# EasyEDA schematic 4R100W.json
TITLE: Sheet_1; REV: 1.0; Date: 2025-04-25; Sheet: 1/1; Drawn By: siberia-09; Company: Your Company
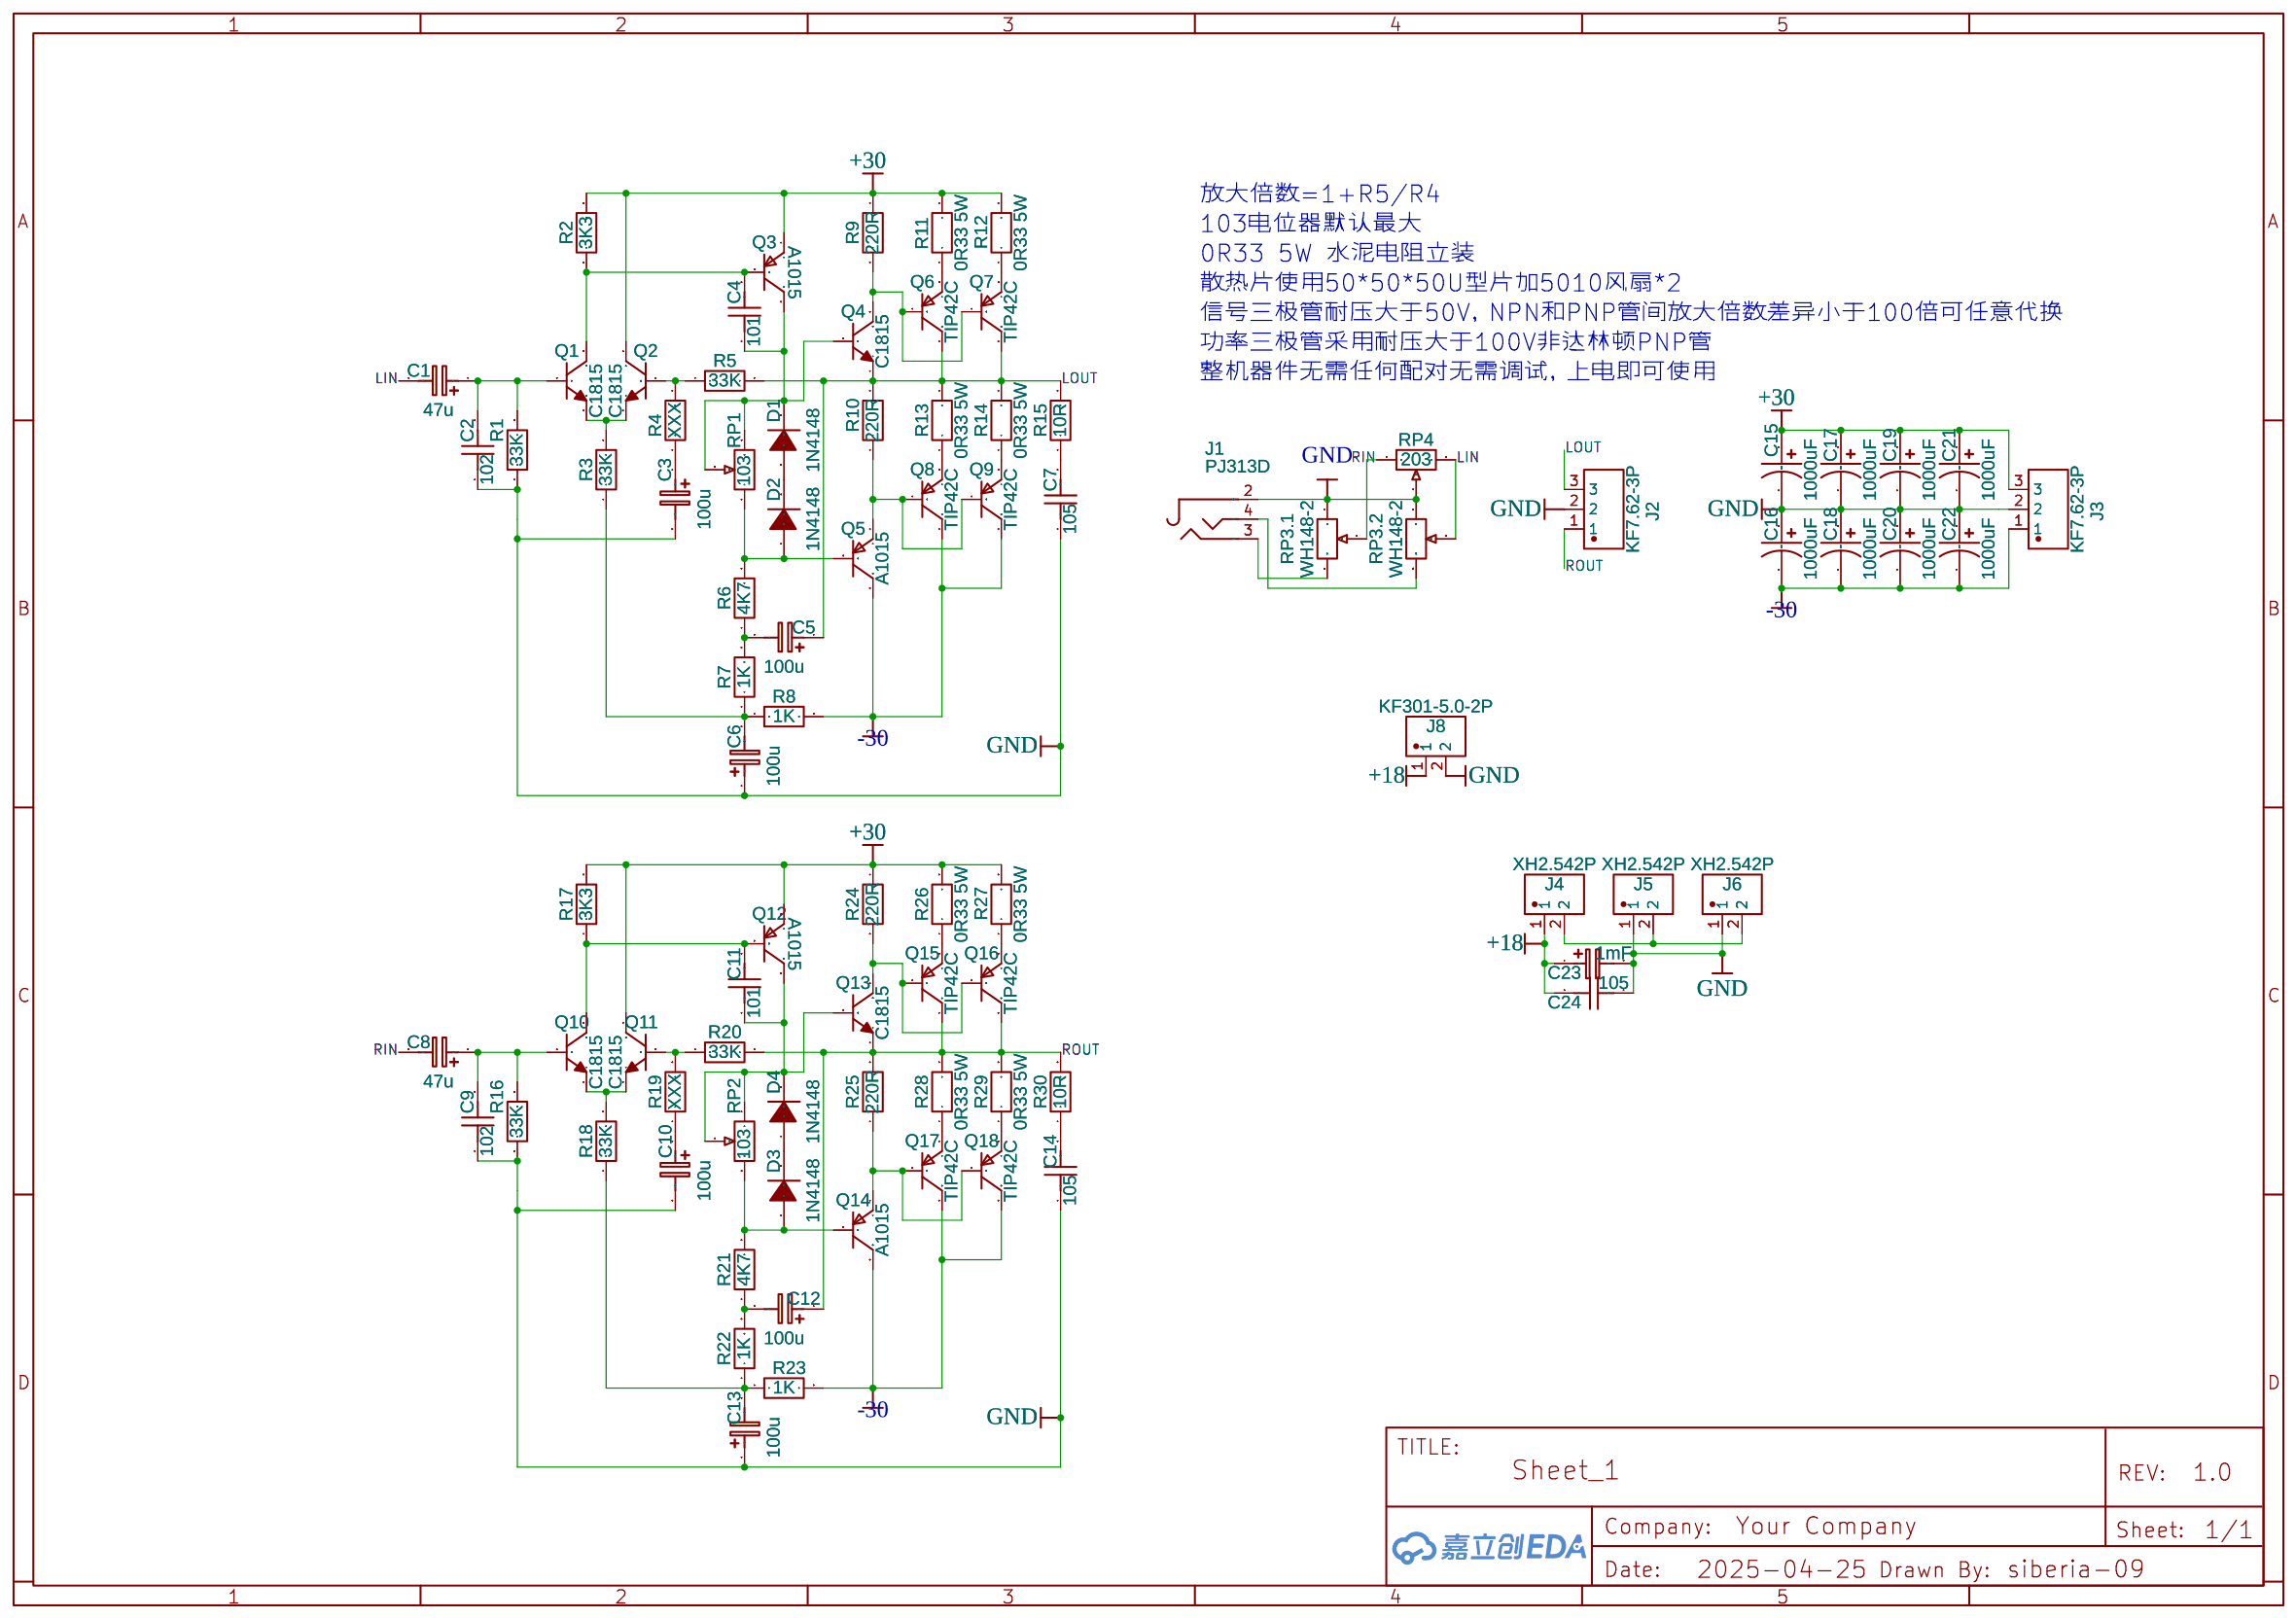
[diagram p0: schematic sheet]

## Parts
C1  47u  [CAP-8*12]
C2  102  [RAD-0.1]
C3  100u  [CAP-8*12]
C4  101  [RAD-0.1]
C5  100u  [CAP-8*12]
C6  100u  [CAP-8*12]
C7  105  [RAD-0.1]
C8  47u  [CAP-8*12]
C9  102  [RAD-0.1]
C10  100u  [CAP-8*12]
C11  101  [RAD-0.1]
C12  100u  [CAP-8*12]
C13  100u  [CAP-8*12]
C14  105  [RAD-0.1]
C15  1000uF  [CAP-13*25]
C16  1000uF  [CAP-13*25]
C17  1000uF  [CAP-13*25]
C18  1000uF  [CAP-13*25]
C19  1000uF  [CAP-13*25]
C20  1000uF  [CAP-13*25]
C21  1000uF  [CAP-13*25]
C22  1000uF  [CAP-13*25]
C23  1mF  [CAP-10*17]
C24  105  [RAD-0.1]
D1  1N4148  [DO-35_BD2.0-L4.0-P8.00-D0.5-FD]
D2  1N4148  [DO-35_BD2.0-L4.0-P8.00-D0.5-FD]
D3  1N4148  [DO-35_BD2.0-L4.0-P8.00-D0.5-FD]
D4  1N4148  [DO-35_BD2.0-L4.0-P8.00-D0.5-FD]
J1  PJ313D  [AUDIO-TH_PJ313D]
J2  KF7.62-3P  [CONN-TH_KF7.62-3P]
J3  KF7.62-3P  [CONN-TH_KF7.62-3P]
J4  XH2.542P  [CONN-TH_XH2.54-2P]
J5  XH2.542P  [CONN-TH_XH2.54-2P]
J6  XH2.542P  [CONN-TH_XH2.54-2P]
J8  KF301-5.0-2P  [CONN-TH_P5.00_KF301-5.0-2P]
Q1  C1815  [TO-92-3_L4.9-W3.7-P1.27-L]
Q2  C1815  [TO-92-3_L4.9-W3.7-P1.27-L]
Q3  A1015  [TO-92-3_L4.9-W3.7-P1.27-L]
Q4  C1815  [TO-92-3_L4.9-W3.7-P1.27-L]
Q5  A1015  [TO-92-3_L4.9-W3.7-P1.27-L]
Q6  TIP42C  [TO-220-3_L10.0-W4.5-P2.54-T]
Q7  TIP42C  [TO-220-3_L10.0-W4.5-P2.54-T]
Q8  TIP42C  [TO-220-3_L10.0-W4.5-P2.54-T]
Q9  TIP42C  [TO-220-3_L10.0-W4.5-P2.54-T]
Q10  C1815  [TO-92-3_L4.9-W3.7-P1.27-L]
Q11  C1815  [TO-92-3_L4.9-W3.7-P1.27-L]
Q12  A1015  [TO-92-3_L4.9-W3.7-P1.27-L]
Q13  C1815  [TO-92-3_L4.9-W3.7-P1.27-L]
Q14  A1015  [TO-92-3_L4.9-W3.7-P1.27-L]
Q15  TIP42C  [TO-220-3_L10.0-W4.5-P2.54-T]
Q16  TIP42C  [TO-220-3_L10.0-W4.5-P2.54-T]
Q17  TIP42C  [TO-220-3_L10.0-W4.5-P2.54-T]
Q18  TIP42C  [TO-220-3_L10.0-W4.5-P2.54-T]
R1  33K  [R_AXIAL-0.3]
R2  3K3  [R_AXIAL-0.3]
R3  33K  [R_AXIAL-0.3]
R4  XXX  [R_AXIAL-0.3]
R5  33K  [R_AXIAL-0.3]
R6  4K7  [R_AXIAL-0.3]
R7  1K  [R_AXIAL-0.3]
R8  1K  [R_AXIAL-0.3]
R9  220R  [R_AXIAL-0.3]
R10  220R  [R_AXIAL-0.3]
R11  0R33 5W  [R_AXIAL-0.4]
R12  0R33 5W  [R_AXIAL-0.4]
R13  0R33 5W  [R_AXIAL-0.4]
R14  0R33 5W  [R_AXIAL-0.4]
R15  10R  [R_AXIAL-0.3]
R16  33K  [R_AXIAL-0.3]
R17  3K3  [R_AXIAL-0.3]
R18  33K  [R_AXIAL-0.3]
R19  XXX  [R_AXIAL-0.3]
R20  33K  [R_AXIAL-0.3]
R21  4K7  [R_AXIAL-0.3]
R22  1K  [R_AXIAL-0.3]
R23  1K  [R_AXIAL-0.3]
R24  220R  [R_AXIAL-0.3]
R25  220R  [R_AXIAL-0.3]
R26  0R33 5W  [R_AXIAL-0.4]
R27  0R33 5W  [R_AXIAL-0.4]
R28  0R33 5W  [R_AXIAL-0.4]
R29  0R33 5W  [R_AXIAL-0.4]
R30  10R  [R_AXIAL-0.3]
RP1  103  [RES-ADJ-SMD_RM065-V1]
RP2  103  [RES-ADJ-SMD_RM065-V1]
RP3  WH148-2  [WH148电位器双]  (sections 1,2)
RP4  203  [RES-ADJ-SMD_RM065-V1]

## Library data of the parts
C1 C3 C5 C6 C8 C10 C12 C13 C23 = C_Tan_SMD_A_EU: Contributor: LCEDA_Lib
C2 C4 C7 C9 C11 C14 C24 = C_RAD-0.1_US: Contributor: LCEDA_Lib
C15-C22 = SHF1000UF35V01EC4584: Contributor: lcsc; Supplier: LCSC; Supplier Part: C2992582; Manufacturer: KNSCHA(科尼盛)
D1-D4 = 1N4148: Supplier: LCSC; Manufacturer: ST(先科); Supplier Part: C14516; JLCPCB Part Class: Extended Part
J1 = PJ313D: Supplier: LCSC; Manufacturer: BOOMELE(博穆精密); Manufacturer Part: 313耳机座直插; Supplier Part: C18167; JLCPCB Part Class: Extended Part
J2 J3 = KF7.62-3P: Contributor: LCSC; Supplier: LCSC; Supplier Part: C707825; Manufacturer: KEFA(科发); JLCPCB Part Class: Extended Part
J4-J6 = XH2.542P插座: Contributor: lcsc; Supplier: LCSC; Supplier Part: C9900016948; Manufacturer: null
J8 = KF301-5.0-2P: Contributor: LCSC; Supplier: LCSC; Supplier Part: C474881; Manufacturer: KEFA(科发); JLCPCB Part Class: Extended Part
Q1 Q2 Q4 Q10 Q11 Q13 = C1815: Supplier: LCSC; Manufacturer: CJ(江苏长电/长晶); Manufacturer Part: C1815-TA; Supplier Part: C57616; JLCPCB Part Class: Extended Part
Q3 Q5 Q12 Q14 = 2SA1015_C168617: Contributor: 立创EDA官方封装库; Supplier Part: C168617; Supplier: LCSC; Manufacturer: CJ(江苏长电/长晶); Manufacturer Part: 2SA1015(RANGE:200-400); JLCPCB Part Class: Extended Part
Q6-Q9 Q15-Q18 = TIP42C: Supplier: LCSC; Manufacturer: CJ(江苏长电/长晶); Supplier Part: C92311; JLCPCB Part Class: Extended Part
R1 R3-R16 R18-R30 = R_AXIAL-0.3_EU: Contributor: LCEDA_Lib
R2 R17 = R_0805_EU: Contributor: LCEDA_Lib
RP1 RP2 RP4 = R_3386P_EU: Supplier: LCSC; Contributor: LCEDA_Lib; Value(Ω): 10K
RP3 = WH148-2: Contributor: l3861547; subpart_no: 1

## Nets
GND: C2.1 C3.2 C6.1 C7.1 C9.1 C10.2 C13.1 C14.1 C15.2 C16.1 C17.2 C18.1 C19.2 C20.1 C21.2 C22.1 C23.2 C24.1 J1.2 J2.2 J3.2 J5.1 J6.1 J8.2 R1.1 R16.1 RP3.A1 RP3.A2 RP4.2
+18: C23.1 C24.2 J4.1 J8.1
+30: C15.1 C17.1 C19.1 C21.1 J3.3 Q2.2(C) Q3.1(E) Q11.2(C) Q12.1(E) R2.2 R9.1 R11.2 R12.2 R17.2 R24.1 R26.2 R27.2
-30: C16.2 C18.2 C20.2 C22.2 J3.1 Q5.2(C) Q8.2(C) Q9.2(C) Q14.2(C) Q17.2(C) Q18.2(C) R8.2 R23.2
LIN: C1.2 RP3.W2 RP4.3
LOUT: C5.1 J2.3 Q4.1(E) Q6.2(C) Q7.2(C) R5.2 R10.2 R13.2 R14.2 R15.2
RIN: C8.2 RP3.W1 RP4.1
ROUT: C12.1 J2.1 Q13.1(E) Q15.2(C) Q16.2(C) R20.2 R25.2 R28.2 R29.2 R30.2
Net-(C1-1): C1.1 C2.2 Q1.3(B) R1.2
Net-(C3-1): C3.1 R4.1
Net-(C4-1): C4.1 D1.2(C) Q3.2(C) Q4.3(B) RP1.2 RP1.3
Net-(C4-2): C4.2 Q1.2(C) Q3.3(B) R2.1
Net-(C5-2): C5.2 R6.1 R7.2
Net-(C6-2): C6.2 R3.1 R7.1 R8.1
Net-(C7-2): C7.2 R15.1
Net-(C8-1): C8.1 C9.2 Q10.3(B) R16.2
Net-(C10-1): C10.1 R19.1
Net-(C11-1): C11.1 D4.2(C) Q12.2(C) Q13.3(B) RP2.1 RP2.2
Net-(C11-2): C11.2 Q10.2(C) Q12.3(B) R17.1
Net-(C12-2): C12.2 R21.1 R22.2
Net-(C13-2): C13.2 R18.1 R22.1 R23.1
Net-(C14-2): C14.2 R30.1
Net-(D1-1): D1.1(A) D2.2(C)
Net-(D2-1): D2.1(A) Q5.3(B) R6.2 RP1.1
Net-(D3-1): D3.1(A) Q14.3(B) R21.2 RP2.3
Net-(D3-2): D3.2(C) D4.1(A)
Net-(J1-3): J1.3 RP3.B1
Net-(J1-4): J1.4 RP3.B2
Net-(J4-2): J4.2 J5.2 J6.2
Net-(Q1-1): Q1.1(E) Q2.1(E) R3.2
Net-(Q2-3): Q2.3(B) R4.2 R5.1
Net-(Q4-2): Q4.2(C) Q6.1(B) Q7.1(B) R9.2
Net-(Q5-1): Q5.1(E) Q8.1(B) Q9.1(B) R10.1
Net-(Q6-3): Q6.3(E) R11.1
Net-(Q7-3): Q7.3(E) R12.1
Net-(Q8-3): Q8.3(E) R13.1
Net-(Q9-3): Q9.3(E) R14.1
Net-(Q10-1): Q10.1(E) Q11.1(E) R18.2
Net-(Q11-3): Q11.3(B) R19.2 R20.1
Net-(Q13-2): Q13.2(C) Q15.1(B) Q16.1(B) R24.2
Net-(Q14-1): Q14.1(E) Q17.1(B) Q18.1(B) R25.1
Net-(Q15-3): Q15.3(E) R26.1
Net-(Q16-3): Q16.3(E) R27.1
Net-(Q17-3): Q17.3(E) R28.1
Net-(Q18-3): Q18.3(E) R29.1

## Notes on the sheet
- 放大倍数=1+R5/R4
- 103电位器默认最大
- 0R33 5W 水泥电阻立装
- 散热片使用50*50*50U型片加5010风扇*2
- 信号三极管耐压大于50V，NPN和PNP管间放大倍数差异小于100倍可任意代换
- 功率三极管采用耐压大于100V非达林顿PNP管
- 整机器件无需任何配对无需调试，上电即可使用
